# EAGLE schematic dual_encoder_shield_5v_revc (EAGLE 9.6.2)
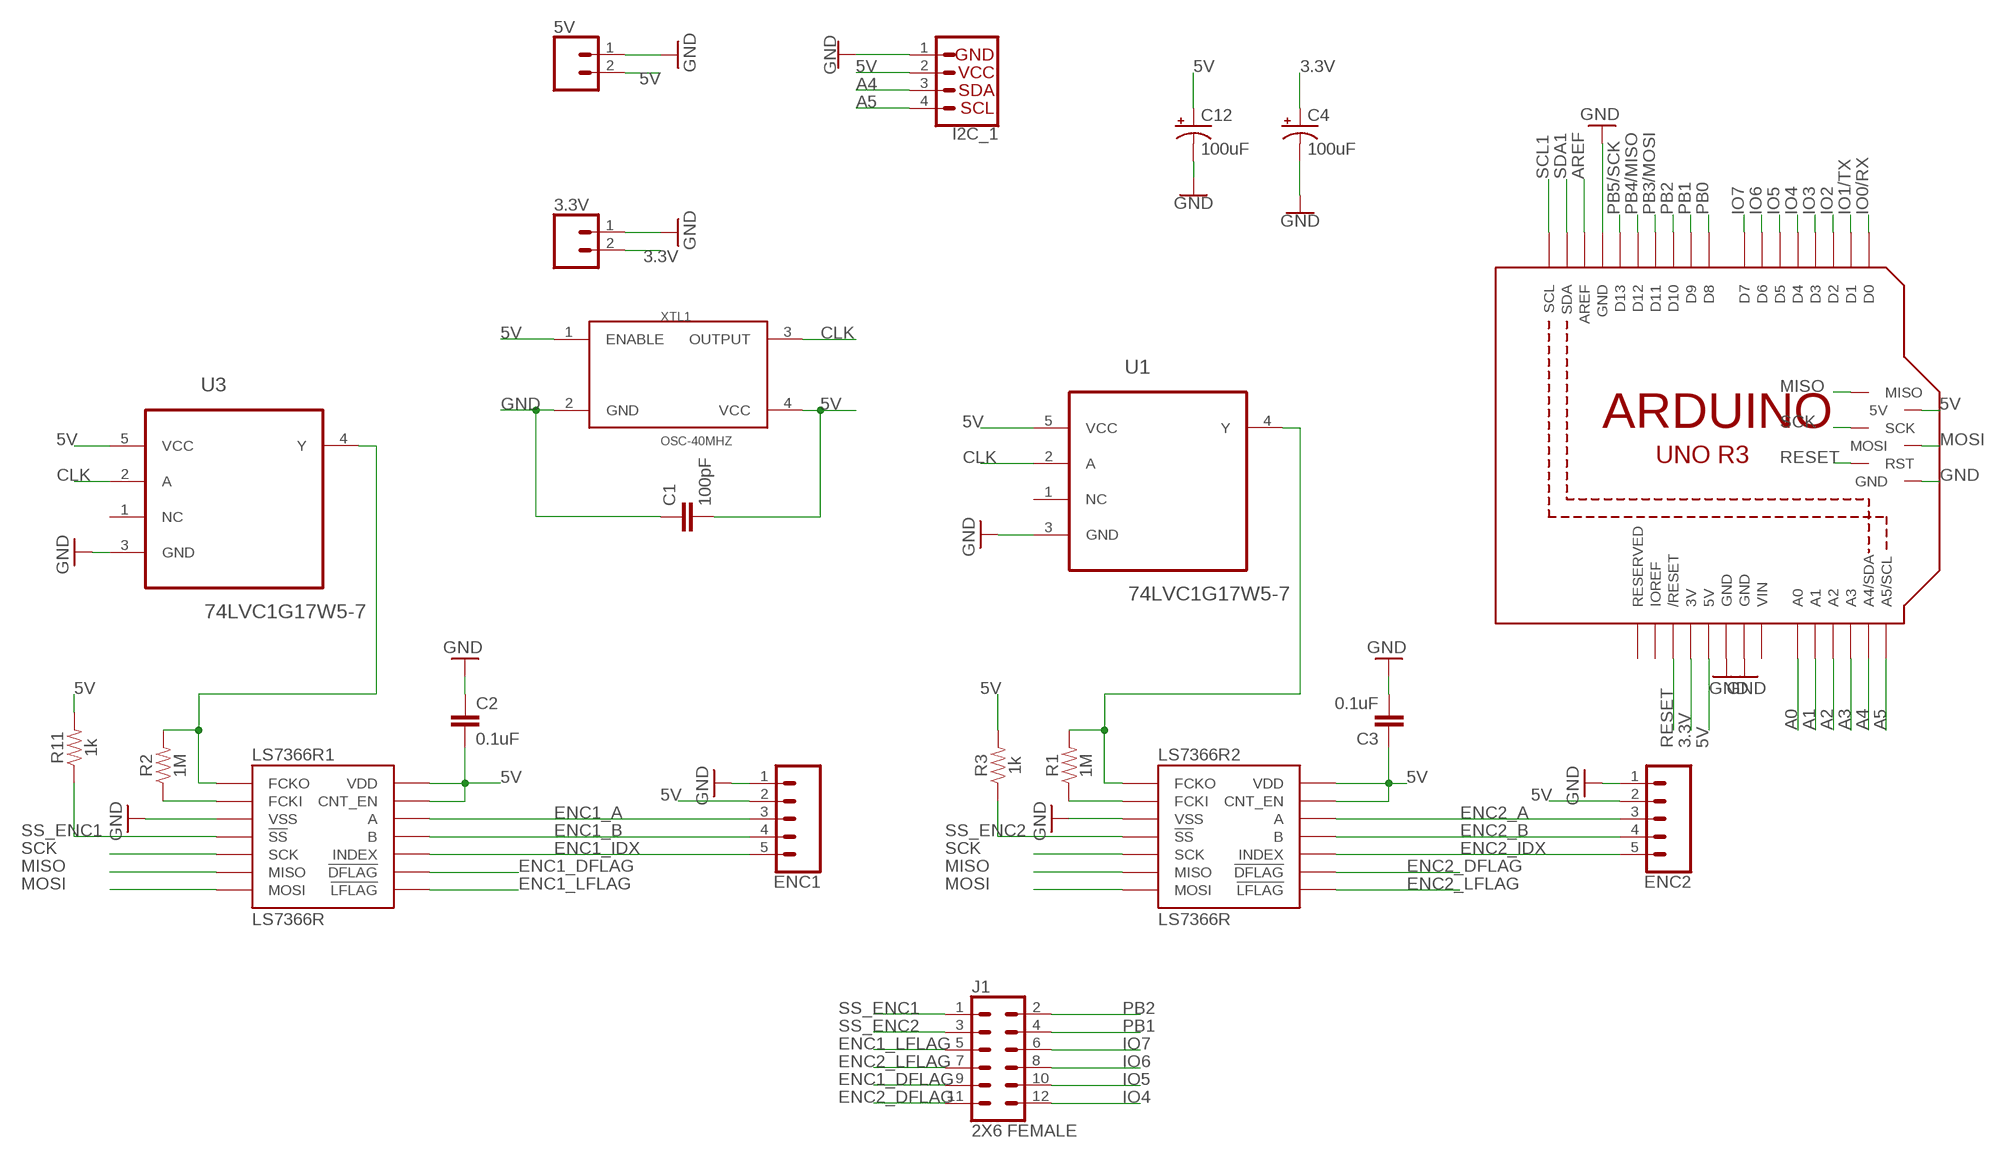
[diagram p0: schematic, sheet 1]

## Parts
3.3V  CONN_02-JST-2MM-SMT  [JST-2-SMD]
5V  CONN_02-JST-2MM-SMT  [JST-2-SMD]
C1  100pF  100PF-0603-50V-5%  [0603]
C2  0.1uF  0.1UF-0603-25V-5%  [0603]
C3  0.1uF  0.1UF-0603-25V-5%  [0603]
C4  100uF  100UF-POLAR-25V-20%(ELEC)  [PANASONIC_D]
C12  100uF  100UF-POLAR-25V-20%(ELEC)  [PANASONIC_D]
ENC1  CONN_05  [1X05]
ENC2  CONN_05  [1X05]
I2C_1  QWIIC_CONNECTORJS-1MM  [JST04_1MM_RA]
J1  2X6 FEMALE  CONN_06X2PTH_FEMALE  [2X6]
LS7366R1  LS7366R  [SOIC14]
LS7366R2  LS7366R  [SOIC14]
M1  ARDUINO_R3_ICSP  [ARDUINOR3_ICSP]
R1  1M  1MOHM-0603-1/4W-5%  [0603]
R2  1M  1MOHM-0603-1/4W-5%  [0603]
R3  1k  1KOHM-0603-1/10W-1%  [0603]
R11  1k  1KOHM-0603-1/10W-1%  [0603]
U1  74LVC1G17W5-7  [SOT95P280X145-5N]
U3  74LVC1G17W5-7  [SOT95P280X145-5N]
XTL1  OSC-40MHZ  [OSC_CB3LV-5I-50M000000]

## Nets
3.3V: 3.3V.2 C4.+ M1.3V
5V: 5V.2 C1.2 C2.2 C3.1 C12.+ ENC1.2 ENC2.2 I2C_1.2 LS7366R1.13(CNT_EN) LS7366R1.14(VDD) LS7366R2.13(CNT_EN) LS7366R2.14(VDD) M1.5V M1.5V_ICSP(5V) R3.2 R11.2 U1.5(VCC) U3.5(VCC) XTL1.1(ENABLE) XTL1.4(VCC)
A0: M1.A0
A1: M1.A1
A2: M1.A2
A3: M1.A3
A4: I2C_1.3 M1.A4(A4/SDA)
A5: I2C_1.4 M1.A5(A5/SCL)
AREF: M1.AREF
CLK: U1.2(A) U3.2(A) XTL1.3(OUTPUT)
ENC1_A: ENC1.3 LS7366R1.12(A)
ENC1_B: ENC1.4 LS7366R1.11(B)
ENC1_DFLAG: J1.9 LS7366R1.9(!DFLAG)
ENC1_IDX: ENC1.5 LS7366R1.10(INDEX)
ENC1_LFLAG: J1.5 LS7366R1.8(!LFLAG)
ENC2_A: ENC2.3 LS7366R2.12(A)
ENC2_B: ENC2.4 LS7366R2.11(B)
ENC2_DFLAG: J1.11 LS7366R2.9(!DFLAG)
ENC2_IDX: ENC2.5 LS7366R2.10(INDEX)
ENC2_LFLAG: J1.7 LS7366R2.8(!LFLAG)
GND: 3.3V.1 5V.1 C1.1 C2.1 C3.2 C4.- C12.- ENC1.1 ENC2.1 I2C_1.1 LS7366R1.3(VSS) LS7366R2.3(VSS) M1.GND M1.GND@1(GND) M1.GND@2(GND) M1.GND@3(GND) U1.3(GND) U3.3(GND) XTL1.2(GND)
IO0/RX: M1.D0
IO1/TX: M1.D1
IO2: M1.D2
IO3: M1.D3
IO4: J1.12 M1.D4
IO5: J1.10 M1.D5
IO6: J1.8 M1.D6
IO7: J1.6 M1.D7
MISO: LS7366R1.6(MISO) LS7366R2.6(MISO) M1.MISO
MOSI: LS7366R1.7(MOSI) LS7366R2.7(MOSI) M1.MOSI
N$6: LS7366R1.2(FCKI) R2.1
N$8: LS7366R2.1(FCKO) R1.2 U1.4(Y)
N$9: LS7366R2.2(FCKI) R1.1
N$10: LS7366R1.1(FCKO) R2.2 U3.4(Y)
PB0: M1.D8
PB1: J1.4 M1.D9
PB2: J1.2 M1.D10
PB3/MOSI: M1.D11
PB4/MISO: M1.D12
PB5/SCK: M1.D13
RESET: M1.RESET(/RESET) M1.RESET_ICSP(RST)
SCK: LS7366R1.5(SCK) LS7366R2.5(SCK) M1.SCK
SCL1: M1.SCL
SDA1: M1.SDA
SS_ENC1: J1.1 LS7366R1.4(!SS) R11.1
SS_ENC2: J1.3 LS7366R2.4(!SS) R3.1
Unconnected: M1.IOREF M1.RESERVED U1.1(NC) U3.1(NC)

## Power pins joined to a net without a drawn wire
VIN: M1.VIN

## Library data of the parts
3.3V 5V = SparkFun-Connectors:CONN_02: Multi connection point. Often used as Generic Header-pin footprint for 0.1 inch spaced/style header connections On any of the 0.1 inch spaced packages, you can populate with these: Break Away Headers - Straight <https://www.sparkfun.com/products/116> (PRT-00116) Break Away Male Headers - Right Angle <https://www.sparkfun.com/products/553> (PRT-00553) Female Headers <https://www.sparkfun.com/products/115> (PRT-00115) Break Away Headers - Machine Pin <https://www.sparkfun.com/products/117> (PRT-00117) Break Away Female Headers - Swiss Machine Pin <https://www.sparkfun.com/products/743> (PRT-00743) For SCREWTERMINALS and SPRING TERMINALS visit here: Screw Terimnals on SparkFun.com <https://www.sparkfun.com/search/results?term=Screw+Terminals> (5mm/3.5mm/2.54mm spacing) This device is also useful as a general connection point to wire up your design to another part of your project. Our various solder wires solder well into these plated through hole pads. Hook-Up Wire - Assortment (Stranded, 22 AWG) <https://www.sparkfun.com/products/11375> (PRT-11375) Hook-Up Wire - Assortment (Solid Core, 22 AWG) <https://www.sparkfun.com/products/11367> (PRT-11367) View the entire wire category on our website here <https://www.sparkfun.com/categories/141> Special notes: Molex polarized connector foot print use with: PRT-08233 with associated crimp pins and housings. 2.54_SCREWTERM for use with PRT-10571. 3.5mm Screw Terminal footprints for PRT-08084 5mm Screw Terminal footprints for use with PRT-08432; PROD_ID: CONN-11443
C1 = SparkFun-Capacitors:100PF: 100pF/0.1nF ceramic capacitors A capacitor is a passive two-terminal electrical component used to store electrical energy temporarily in an electric field.; PROD_ID: CAP-07883
C2 C3 = SparkFun-Capacitors:0.1UF: 0.1µF ceramic capacitors A capacitor is a passive two-terminal electrical component used to store electrical energy temporarily in an electric field.; PROD_ID: CAP-08604
C4 C12 = SparkFun-Capacitors:100UF-POLAR: 100µF polarized capacitors A capacitor is a passive two-terminal electrical component used to store electrical energy temporarily in an electric field.; PROD_ID: CAP-12547
ENC1 ENC2 = SparkFun-Connectors:CONN_05: Multi connection point. Often used as Generic Header-pin footprint for 0.1 inch spaced/style header connections On any of the 0.1 inch spaced packages, you can populate with these: Break Away Headers - Straight <https://www.sparkfun.com/products/116> (PRT-00116) Break Away Male Headers - Right Angle <https://www.sparkfun.com/products/553> (PRT-00553) Female Headers <https://www.sparkfun.com/products/115> (PRT-00115) Break Away Headers - Machine Pin <https://www.sparkfun.com/products/117> (PRT-00117) Break Away Female Headers - Swiss Machine Pin <https://www.sparkfun.com/products/743> (PRT-00743) For SCREWTERMINALS and SPRING TERMINALS visit here: Screw Terimnals on SparkFun.com <https://www.sparkfun.com/search/results?term=Screw+Terminals> (5mm/3.5mm/2.54mm spacing) This device is also useful as a general connection point to wire up your design to another part of your project. Our various solder wires solder well into these plated through hole pads. Hook-Up Wire - Assortment (Stranded, 22 AWG) <https://www.sparkfun.com/products/11375> (PRT-11375) Hook-Up Wire - Assortment (Solid Core, 22 AWG) <https://www.sparkfun.com/products/11367> (PRT-11367) View the entire wire category on our website here <https://www.sparkfun.com/categories/141> Special notes: Molex polarized connector foot print use with SKU : PRT-08231 with associated crimp pins and housings. 1MM SMD Version SKU: PRT-10208
I2C_1 = SparkFun-Connectors:QWIIC_CONNECTOR: SparkFun I2C Standard Qwiic Connector An SMD 1mm pitch JST connector makes it easy and quick (get it? Qwiic?) to connect I2C devices to each other. The Qwiic system <http://www.sparkfun.com/qwiic> enables fast and solderless connection between popular platforms and various sensors and actuators. We carry 200mm <https://www.sparkfun.com/products/14204>, 100mm <https://www.sparkfun.com/products/14205>, 50mm <https://www.sparkfun.com/products/14206>, and breadboard friendly <https://www.sparkfun.com/products/14207> Qwiic cables. We also offer 10 pcs strips <https://www.sparkfun.com/products/14323> the SMD connectors.; PROD_ID: CONN-13694
J1 = SparkFun-Connectors:CONN_06X2: Multi connection point. Often used as Generic Header-pin footprint for 0.1 inch spaced/style header connections On any of the 0.1 inch spaced packages, you can populate with these: Break Away Headers - Straight <https://www.sparkfun.com/products/116> (PRT-00116) Break Away Male Headers - Right Angle <https://www.sparkfun.com/products/553> (PRT-00553) Female Headers <https://www.sparkfun.com/products/115> (PRT-00115) Break Away Headers - Machine Pin <https://www.sparkfun.com/products/117> (PRT-00117) Break Away Female Headers - Swiss Machine Pin <https://www.sparkfun.com/products/743> (PRT-00743); PROD_ID: CONN-12423
LS7366R1 LS7366R2 = LS7366R:LS7366R; AVAILABILITY: Unavailable; MF: LSI; MP: LS7366R; PACKAGE: None; PRICE: None
M1 = adafruit:ARDUINO_R3_ICSP
R1 R2 = SparkFun-Resistors:1MOHM: 1MΩ resistor A resistor is a passive two-terminal electrical component that implements electrical resistance as a circuit element. Resistors act to reduce current flow, and, at the same time, act to lower voltage levels within circuits. - Wikipedia; PROD_ID: RES-07868
R3 R11 = SparkFun-Resistors:1KOHM: 1kΩ resistor A resistor is a passive two-terminal electrical component that implements electrical resistance as a circuit element. Resistors act to reduce current flow, and, at the same time, act to lower voltage levels within circuits. - Wikipedia; PROD_ID: RES-07856
U1 U3 = 74LVC1G17W5-7:74LVC1G17W5-7: SCHMITT-TRIGGER INVERETER; DESCRIPTION: Buffer, Non-Inverting 1 Element 1 Bit per Element Push-Pull Output SOT-25; DIGI-KEY_PART_NUMBER: 74LVC1G17W5-7TR-ND; MF: Diodes Inc.; MP: 74LVC1G17W5-7; PACKAGE: SOT-753 Diodes Inc.; PURCHASE-URL: https://pricing.snapeda.com/search/part/74LVC1G17W5-7/?ref=eda
XTL1 = steveo:OSC-40MHZ